# EAGLE design pendulum_encoder_board (EAGLE 6.5.0)
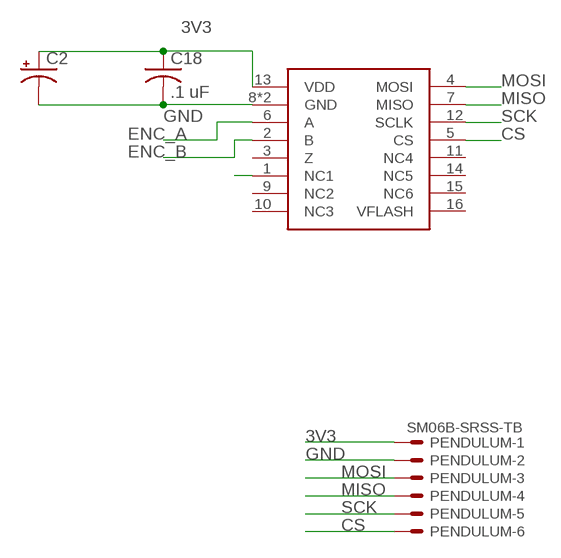
[diagram p0: schematic, sheet 1]

## Parts
C2  CPOL-USE2.5-5  [E2,5-5]
C18  .1 uF  C-USC0402K  [C0402K]
PENDULUM  SM06B-SRSS-TB  [SM06B-SRSS-TB]
U$11  MA700  [QFN16]

## Nets
3V3: C2.+ C18.1 PENDULUM.1 U$11.13(VDD)
CS: PENDULUM.6 U$11.5(CS)
ENC_A: U$11.6(A)
ENC_B: U$11.2(B)
GND: C2.- C18.2 PENDULUM.2 U$11.8(GND) U$11.TH(GND)
MISO: PENDULUM.4 U$11.7(MISO)
MOSI: PENDULUM.3 U$11.4(MOSI)
N$9: U$11.1(NC1)
SCK: PENDULUM.5 U$11.12(SCLK)
Unconnected: U$11.3(Z) U$11.9(NC2) U$11.10(NC3) U$11.11(NC4) U$11.14(NC5) U$11.15(NC6) U$11.16(VFLASH)

## Library data of the parts
C2 = rcl:CPOL-US: POLARIZED CAPACITOR, American symbol
C18 = rcl:C-US: CAPACITOR, American symbol
PENDULUM = con-jst2:?M06B-SRSS-TB: Disconnectable Crimp style connector, 1.0mm pitch 6 contacts
U$11 = BenLibrary:MA700

## Board
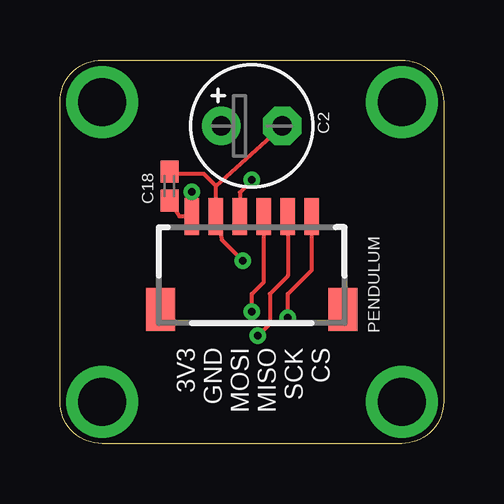
[diagram p1: board, top side]
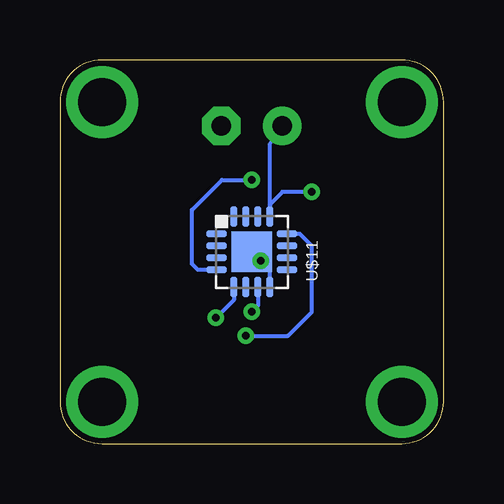
[diagram p2: board, bottom side, seen from below]

Size 16 x 16 mm. Coordinates in mm from the lower left corner, seen from the top.
Outline: 14.25,0 1.75,0 arc-90 0,1.75 0,14.25 arc-90 1.75,16 14.25,16 arc-90 16,14.25 16,1.75 arc-90 14.25,0
Copper layers (1*16): Top 0.035mm / dielectric 1.5mm / Bottom 0.035mm
Design rules "default": minimum track width 10mil, minimum drill 24mil, track to track 8mil, track to pad 8mil, pad to pad 8mil, via to via 8mil, smd to smd 8mil, copper to edge 40mil, drill to drill 8mil, minimum pad ring 10mil, minimum via ring 8mil, stop-mask expansion 4mil, vias tented up to drill 0mil, thermal gap 10mil

### Footprints (pad centres in the part's own frame; a part is rotated, then mirrored left to right if it is on the bottom)
E2,5-5 = drill 0.813 pad 1.6: + -1.27,0 | drill 0.813 pad 1.6 octagon: - 1.27,0
C0402K = smd 0.925 x 0.74: 1 -0.6,0; 2 0.6,0
SM06B-SRSS-TB = smd 0.6 x 1.55: 1 -2.5,2.975; 2 -1.5,2.975; 3 -0.5,2.975; 4 0.5,2.975; 5 1.5,2.975; 6 2.5,2.975 | smd 1.2 x 1.8: FIT@1 -3.8,-0.9; FIT@2 3.8,-0.9
QFN16 = smd 0.85 x 0.3: 1 -1.475,0.75; 2 -1.475,0.25; 3 -1.475,-0.25; 4 -1.475,-0.75; 9 1.475,-0.75; 10 1.475,-0.25; 11 1.475,0.25; 12 1.475,0.75 | smd 0.3 x 0.85: 5 -0.75,-1.475; 6 -0.25,-1.475; 7 0.25,-1.475; 8 0.75,-1.475; 13 0.75,1.475; 14 0.25,1.475; 15 -0.25,1.475; 16 -0.75,1.475 | smd 1.7 x 1.7: TH 0,0

### Placement (x,y rotation side)
C2  8,13.25 0 top
C18  4.57,10.74 90 top
PENDULUM  8,6.5 0 top
U$11  8,8 0 bottom

### Tracks (layer width: path | path; a pad name or v marks a point on that pad's centre or on a via)
3V3  (via drill 0.3)
  Top 0.16: C18.1 4.98,9.47 PENDULUM.1 v5.5,10.5
  Bottom 0.16: C2.+ 7.25,12.48 U$11.13 7.25,9.97 6.72,10.5 v5.5,10.5
CS  (via drill 0.3)
  Top 0.16: v9.5,5.25 9.5,6.25 10.5,7.25 PENDULUM.6
  Bottom 0.16: U$11.5 8.75,6 v9.5,5.25
GND  (via drill 0.3)
  Top 0.16: 6.5,10.75 PENDULUM.2 6.75,8.5 v7.62,7.62 | 6.5,10.75 6,11.25 4.91,11.25 C18.2 | C2.- 9,13 6.5,10.75
  Bottom 0.16: U$11.8 7.25,7.25 v7.62,7.62 U$11.TH
MISO  (via drill 0.3)
  Top 0.16: v8,5.5 8,6.25 8.5,6.75 PENDULUM.4
  Bottom 0.16: U$11.7 7.75,5.75 v8,5.5
MOSI  (via drill 0.3)
  Top 0.16: v8,11 8,10.97 7.5,10.47 PENDULUM.3
  Bottom 0.16: U$11.4 10.25,7.25 10.5,7.5 10.5,9.75 9.25,11 v8,11
N$1  (via drill 2)
  other vias: 1.75,14.25
N$2  (via drill 2)
  other vias: 14.25,14.25
N$3  (via drill 2)
  other vias: 14.25,1.75
N$4  (via drill 2)
  other vias: 1.75,1.75
SCK  (via drill 0.3)
  Top 0.16: PENDULUM.5 9.5,7 8.75,6.25 8.75,5 v8.25,4.5
  Bottom 0.16: v8.25,4.5 6.5,4.5 5.5,5.5 5.5,8.25 6,8.75 U$11.12

### Text on the board
tNames: 3V3 / GND / MOSI / MISO / SCK / CS